# Altium schematic sheet WF-BT-AP6256.SchDoc
size 420 x 289 mm; SheetNumber: 31; SheetTotal: 32
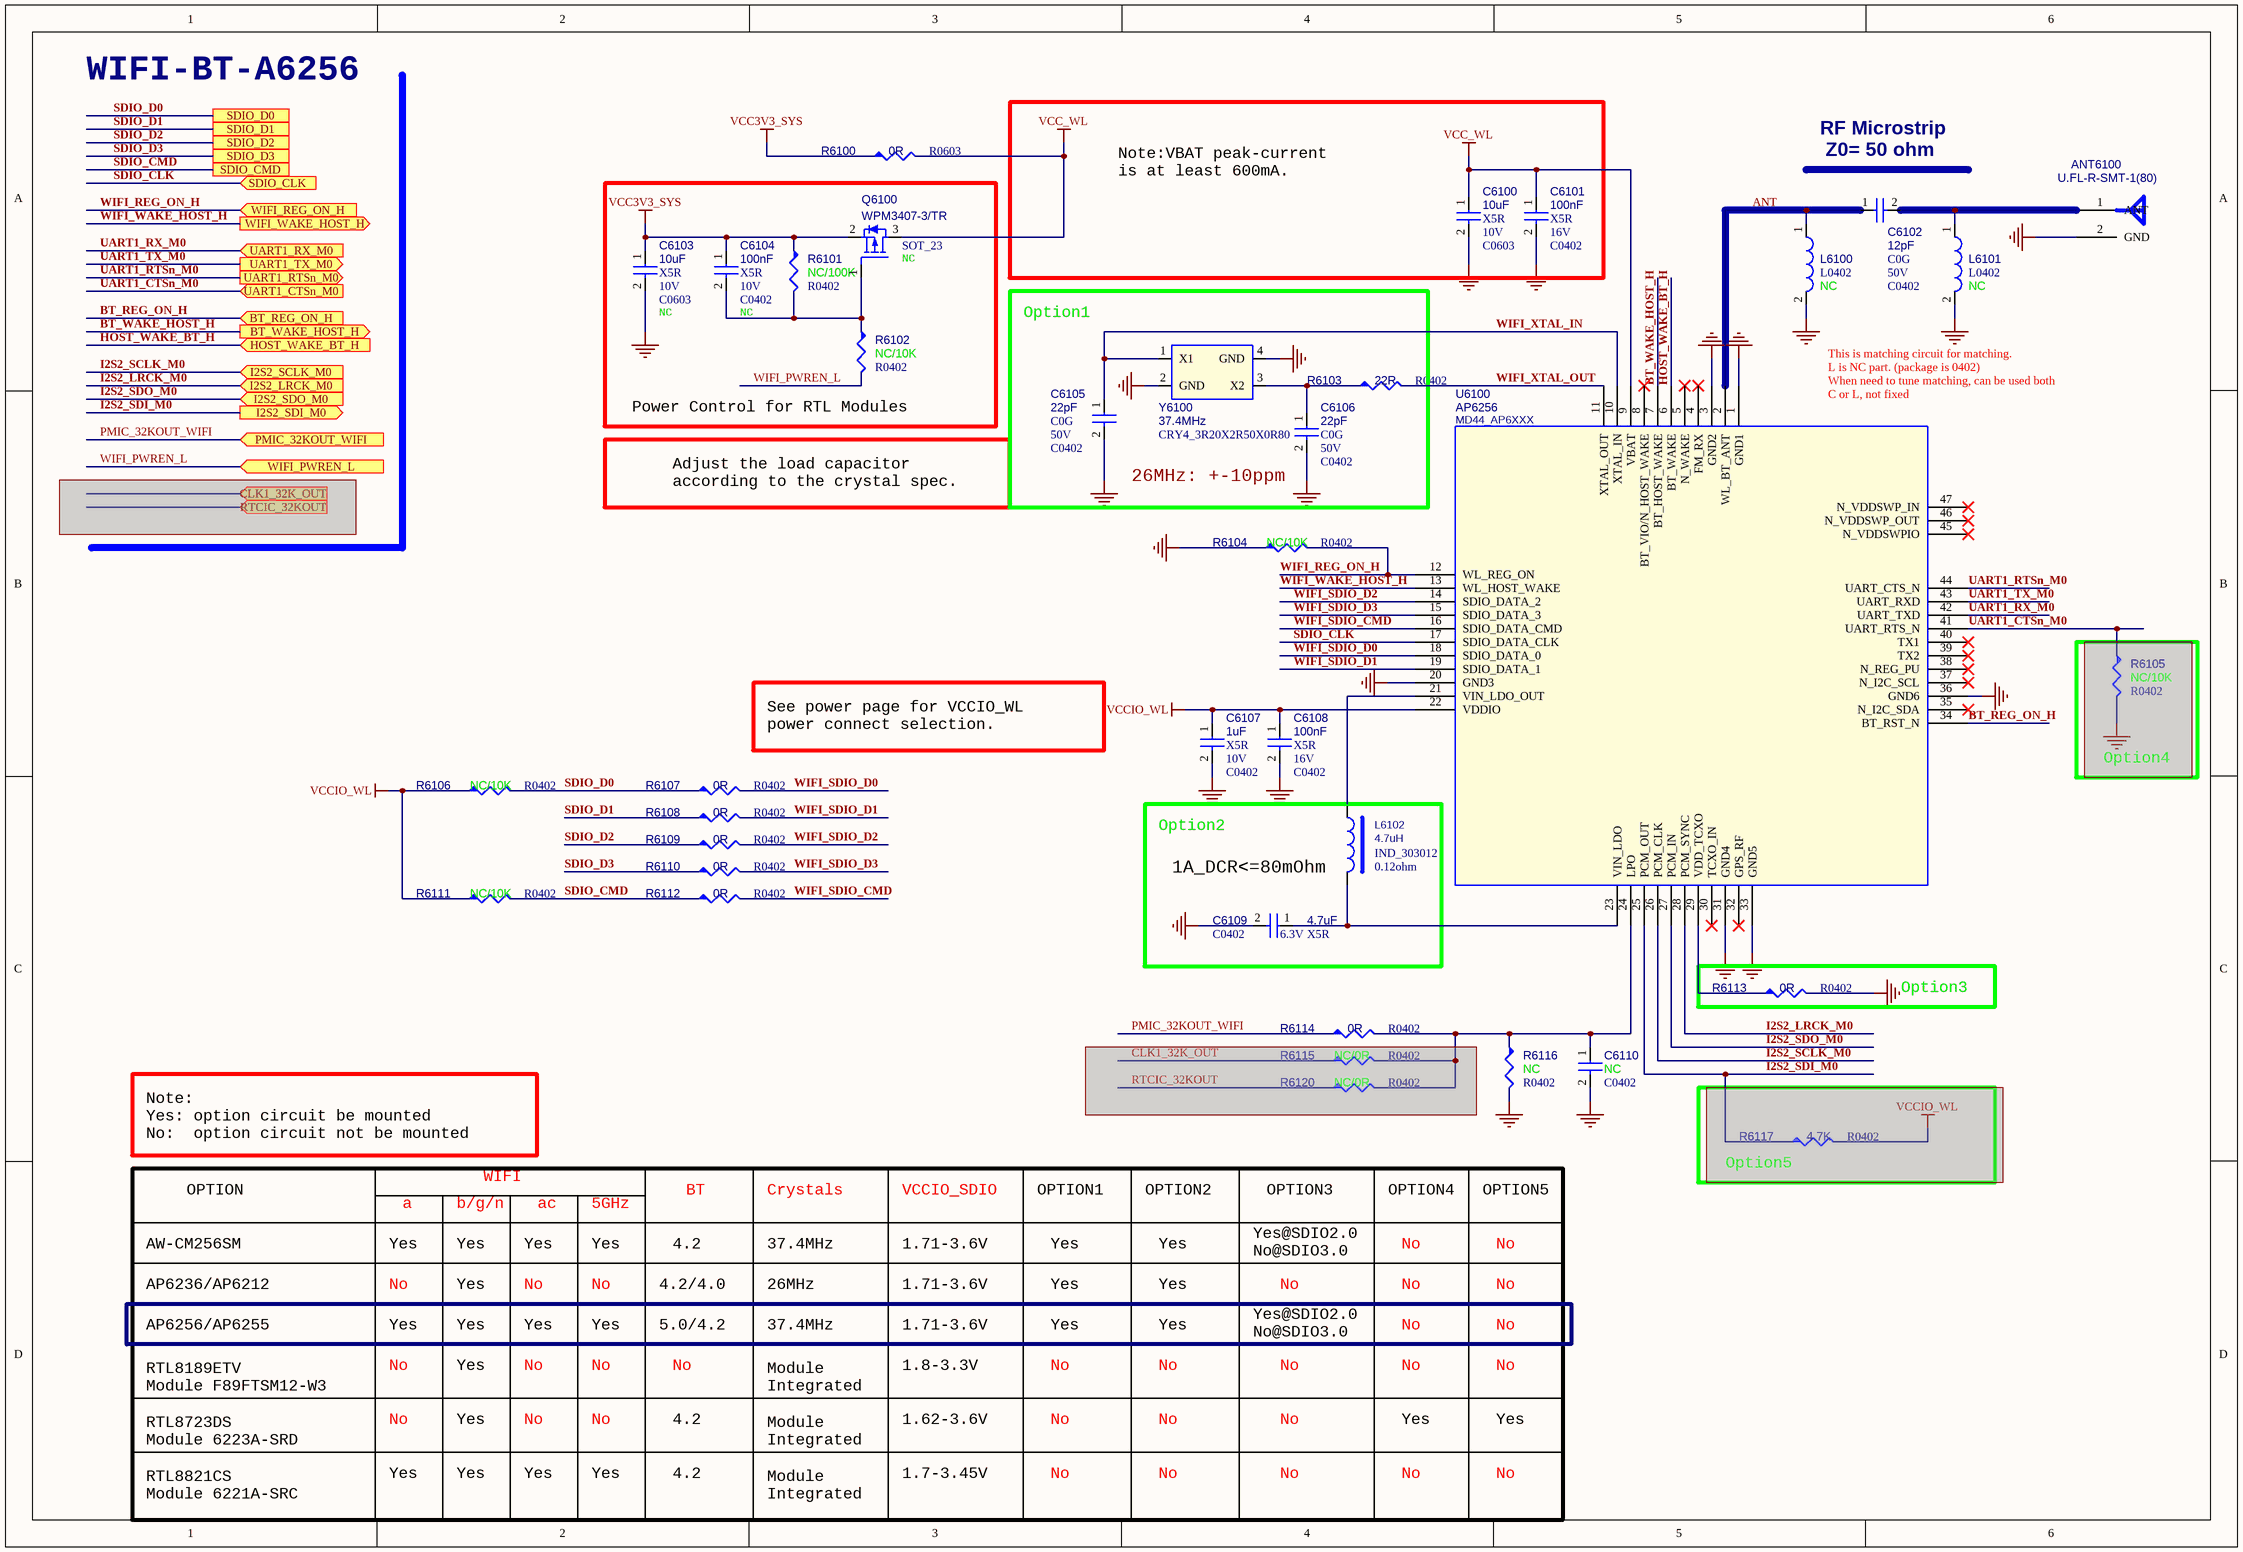
[diagram p0: WF-BT-AP6256.SchDoc]

## Parts
ANT6100  U.FL-R-SMT-1(80)  [IPEX-SMD_BWIPX-1-001E]
C6100  10uF  Dielectric: X5R  Voltage: 10V  [C0603]
C6101  100nF  Dielectric: X5R  Voltage: 16V  [C0402]
C6102  12pF  Dielectric: C0G  Voltage: 50V  [C0402]
C6103  10uF  Dielectric: X5R  Voltage: 10V  option: NC  [C0603]
C6104  100nF  Dielectric: X5R  Voltage: 10V  option: NC  [C0402]
C6105  22pF  Dielectric: C0G  Voltage: 50V  [C0402]
C6106  22pF  Dielectric: C0G  Voltage: 50V  [C0402]
C6107  1uF  Dielectric: X5R  Voltage: 10V  [C0402]
C6108  100nF  Dielectric: X5R  Voltage: 16V  [C0402]
C6109  4.7uF  Dielectric: X5R  Voltage: 6.3V  [C0402]
C6110  NC  [C0402]
L6100  NC  [L0402]
L6101  NC  [L0402]
L6102  4.7uH  PCB Footprint: IND_303012  DC Resistor: 0.12ohm  [IND_303015]
Q6100  WPM3407-3/TR  PCB Footprint: SOT_23  option: NC  [SOT23-3D]
R6100  0R  PCB Footprint: R0603  [R0402]
R6101  NC/100K  [R0402]
R6102  NC/10K  [R0402]
R6103  22R  [R0402]
R6104  NC/10K  [R0402]
R6105  NC/10K  [R0402]  (masked out: inside a compile mask, not in the netlist)
R6106  NC/10K  [R0402]
R6107  0R  [R0402]
R6108  0R  [R0402]
R6109  0R  [R0402]
R6110  0R  [R0402]
R6111  NC/10K  [R0402]
R6112  0R  [R0402]
R6113  0R  [R0402]
R6114  0R  [R0402]
R6115  NC/0R  [R0402]  (masked out: inside a compile mask, not in the netlist)
R6116  NC  [R0402]
R6117  4.7K  [R0402]  (masked out: inside a compile mask, not in the netlist)
R6120  NC/0R  [R0402]  (masked out: inside a compile mask, not in the netlist)
U6100  AP6256  PCB Footprint: MD44_AP6XXX  [QFN-44_L12.0-W12.0-P0.90-TL_AP6256]
Y6100  37.4MHz  [CRY4_3R20X2R50X0R80]

## Blocks framed on the sheet
Power Control for RTL Modules: C6103 C6104 Q6100 R6101 R6102
26MHz: +-10ppm: C6105 C6106 R6103 Y6100
Option4: R6105
1A_DCR<=80mOhm: C6109 L6102
Option3: R6113
Option5: R6117

## Ports
BT_REG_ON_H (in, see Controller-RK3562-TOP[7D], CONTROLLER-RK3562[7A], RK3562-PMUIO-OSC-PLL[5C]), BT_WAKE_HOST_H (out, see Controller-RK3562-TOP[7D], CONTROLLER-RK3562[7A], RK3562-PMUIO-OSC-PLL[5C]), CLK1_32K_OUT (in, see Controller-RK3562-TOP[7D], CONTROLLER-RK3562[7A]), HOST_WAKE_BT_H (in, see Controller-RK3562-TOP[7D], CONTROLLER-RK3562[7A], RK3562-PMUIO-OSC-PLL[5C]), I2S2_LRCK_M0 (in, see Controller-RK3562-TOP[7D], CONTROLLER-RK3562[3B], RK3562-VCCIO4[4B]), I2S2_SCLK_M0 (in, see Controller-RK3562-TOP[7D], CONTROLLER-RK3562[3B], RK3562-VCCIO4[4B]), I2S2_SDI_M0 (out, see Controller-RK3562-TOP[7D], CONTROLLER-RK3562[3B], RK3562-VCCIO4[4B]), I2S2_SDO_M0 (in, see Controller-RK3562-TOP[7D], CONTROLLER-RK3562[3B], RK3562-VCCIO4[4B]), PMIC_32KOUT_WIFI (in, see Controller-RK3562-TOP[7D], CONTROLLER-RK3562[1B], RK-POWER-SUPPLY[1A]), RTCIC_32KOUT (in, see Controller-RK3562-TOP[7D], CONTROLLER-RK3562[7A]), SDIO_CLK (in, see Controller-RK3562-TOP[7D], CONTROLLER-RK3562[3B], RK3562-VCCIO4[4A]), SDIO_CMD (see Controller-RK3562-TOP[7D], CONTROLLER-RK3562[3B], RK3562-VCCIO4[4A]), SDIO_D0 (see Controller-RK3562-TOP[7D], CONTROLLER-RK3562[3B], RK3562-VCCIO4[4A]), SDIO_D1 (see Controller-RK3562-TOP[7D], CONTROLLER-RK3562[3B], RK3562-VCCIO4[4A]), SDIO_D2 (see Controller-RK3562-TOP[7D], CONTROLLER-RK3562[3B], RK3562-VCCIO4[4A]), SDIO_D3 (see Controller-RK3562-TOP[7D], CONTROLLER-RK3562[3B], RK3562-VCCIO4[4A]), UART1_CTSn_M0 (in, see Controller-RK3562-TOP[7D], CONTROLLER-RK3562[3B], RK3562-VCCIO4[4B]), UART1_RTSn_M0 (out, see Controller-RK3562-TOP[7D], CONTROLLER-RK3562[3B], RK3562-VCCIO4[4B]), UART1_RX_M0 (in, see Controller-RK3562-TOP[7D], CONTROLLER-RK3562[3B]), UART1_TX_M0 (out, see Controller-RK3562-TOP[7D], CONTROLLER-RK3562[3B]), WIFI_PWREN_L (in, see Controller-RK3562-TOP[7D], CONTROLLER-RK3562[7A]), WIFI_REG_ON_H (in, see Controller-RK3562-TOP[7D], CONTROLLER-RK3562[7A], RK3562-PMUIO-OSC-PLL[5C]), WIFI_WAKE_HOST_H (out, see Controller-RK3562-TOP[7D], CONTROLLER-RK3562[7A], RK3562-PMUIO-OSC-PLL[5C])

## Nets
GND: ANT6100.2(GND) C6100.2 C6101.2 C6103.2 C6105.2 C6106.2 C6107.2 C6108.2 C6109.2 C6110.2 L6100.2 L6101.2 R6104.1 R6113.2 R6116.2 U6100.1(GND1) U6100.3(GND2) U6100.20(GND3) U6100.31(GND4) U6100.33(GND5) U6100.36(GND6) Y6100.2(GND) Y6100.4(GND)
VCC3V3_SYS: C6103.1 C6104.1 Q6100.2(SOURCE) R6100.1 R6101.1
VCC_WL: C6100.1 C6101.1 Q6100.3(DRAIN) R6100.2 U6100.9(VBAT)
VCCIO_WL: C6107.1 C6108.1 R6106.1 R6111.1 U6100.22(VDDIO)
ANT: C6102.1 L6100.1 U6100.2(WL_BT_ANT)
BT_REG_ON_H: U6100.34(BT_RST_N) ; port BT_REG_ON_H
BT_WAKE_HOST_H: U6100.7(BT_HOST_WAKE) ; port BT_WAKE_HOST_H
HOST_WAKE_BT_H: U6100.6(BT_WAKE) ; port HOST_WAKE_BT_H
I2S2_LRCK_M0: U6100.28(PCM_SYNC) ; port I2S2_LRCK_M0
I2S2_SCLK_M0: U6100.26(PCM_CLK) ; port I2S2_SCLK_M0
I2S2_SDI_M0: U6100.25(PCM_OUT) ; port I2S2_SDI_M0
I2S2_SDO_M0: U6100.27(PCM_IN) ; port I2S2_SDO_M0
PMIC_32KOUT_WIFI: R6114.1 ; port PMIC_32KOUT_WIFI
SDIO_CLK: U6100.17(SDIO_DATA_CLK) ; port SDIO_CLK
SDIO_CMD: R6111.2 R6112.1 ; port SDIO_CMD
SDIO_D0: R6106.2 R6107.1 ; port SDIO_D0
SDIO_D1: R6108.1 ; port SDIO_D1
SDIO_D2: R6109.1 ; port SDIO_D2
SDIO_D3: R6110.1 ; port SDIO_D3
UART1_CTSn_M0: U6100.41(UART_RTS_N) ; port UART1_CTSn_M0
UART1_RTSn_M0: U6100.44(UART_CTS_N) ; port UART1_RTSn_M0
UART1_RX_M0: U6100.42(UART_TXD) ; port UART1_RX_M0
UART1_TX_M0: U6100.43(UART_RXD) ; port UART1_TX_M0
WIFI_PWREN_L: R6102.2 ; port WIFI_PWREN_L
WIFI_REG_ON_H: R6104.2 U6100.12(WL_REG_ON) ; port WIFI_REG_ON_H
WIFI_SDIO_CMD: R6112.2 U6100.16(SDIO_DATA_CMD)
WIFI_SDIO_D0: R6107.2 U6100.18(SDIO_DATA_0)
WIFI_SDIO_D1: R6108.2 U6100.19(SDIO_DATA_1)
WIFI_SDIO_D2: R6109.2 U6100.14(SDIO_DATA_2)
WIFI_SDIO_D3: R6110.2 U6100.15(SDIO_DATA_3)
WIFI_WAKE_HOST_H: U6100.13(WL_HOST_WAKE) ; port WIFI_WAKE_HOST_H
WIFI_XTAL_IN: C6105.1 U6100.10(XTAL_IN) Y6100.1(X1)
WIFI_XTAL_OUT: R6103.2 U6100.11(XTAL_OUT)
NetANT6100_1: ANT6100.1(ANT) C6102.2 L6101.1
NetC6104_2: C6104.2 Q6100.1(GATE) R6101.2 R6102.1
NetC6106_1: C6106.1 R6103.1 Y6100.3(X2)
NetC6109_1: C6109.1 L6102.2 U6100.23(VIN_LDO)
NetC6110_1: C6110.1 R6114.2 R6116.1 U6100.24(LPO)
NetL6102_1: L6102.1 U6100.21(VIN_LDO_OUT)
NetR6113_1: R6113.1 U6100.29(VDD_TCXO)

Not connected (* = marked no-connect by the designer): U6100 4(FM_RX)* 5(N_WAKE)* 8(BT_VIO/N_HOST_WAKE)* 30(TCXO_IN)* 32(GPS_RF)* 35(N_I2C_SDA)* 37(N_I2C_SCL)* 38(N_REG_PU)* 39(TX2)* 40(TX1)* 45(N_VDDSWPIO)* 46(N_VDDSWP_OUT)* 47(N_VDDSWP_IN)*

## Notes on the sheet
- WIFI-BT-A6256
- RF Microstrip
  Z0= 50 ohm
- Note:VBAT peak-current
  is at least 600mA.
- Option1
- (near U6100) This is matching circuit for matching.
  L is NC part. (package is 0402)
  When need to tune matching, can be used both C or L, not fixed
- Adjust the load capacitor
  according to the crystal spec.
- See power page for VCCIO_WL
  power connect selection.
- Option2
- Note:
  Yes: option circuit be mounted
  No:  option circuit not be mounted
- OPTION
- a
- b/g/n
- WIFI
- ac
- 5GHz
- BT
- Crystals
- VCCIO_SDIO
- OPTION1
- OPTION2
- OPTION3
- OPTION4
- OPTION5
- AW-CM256SM
- AP6236/AP6212
- Yes
- No
- 4.2/4.0
- 4.2
- 37.4MHz
- 26MHz
- 1.71-3.6V
- Yes@SDIO2.0
  No@SDIO3.0
- AP6256/AP6255
- 5.0/4.2
- 1.8-3.3V
- RTL8189ETV
  Module F89FTSM12-W3
- Module
  Integrated
- 1.62-3.6V
- RTL8723DS
  Module 6223A-SRD
- RTL8821CS
  Module 6221A-SRC
- 1.7-3.45V

## Library data of the parts
ANT6100 = ANT_1P1G: BWIPX-1-001E; Manufacturer: Rockchip
C6100 = CAP NP: cap,10.00uF,+/-10%,10V,X5R,C0603; Part Reference: C6100; Manufacturer PN: C1608X5R1A106K080AC; Manufacturer: TDK; Tolerance: 10%; Priority: A; PCB Footprint: C0603; Value: 10uF; Created by: JJJ; Part Type: C0603; RK PN: C1608X5R1A106K080AC
C6101 = CAP NP: cap,100.00nF,+/-10%,16V,X5R,C0402; Part Reference: C6101; Manufacturer PN: C1005X5R1C104K050BA; Manufacturer: TDK; C_Voltage: 10V; Tolerance: 10%; Priority: A; Number: 37; PCB Footprint: C0402; Value: 100nF; Created by: JJJ; Part Type: C0402; RK PN: C1005X5R1C104K050BA
C6102 = CAP NP: cap,10.00pF,+/-0.5,50V,C0G,C0402; Part Reference: C6102; Manufacturer: TDK; Priority: A; Tolerance: +/-0.5pF; PCB Footprint: C0402; Value: 12pF; Part Type: C0402; Created by: JJJ
C6103 = CAP NP: cap,10.00uF,+/-10%,10V,X5R,C0603; Part Reference: C6103; Manufacturer PN: C1608X5R1A106K080AC; Manufacturer: TDK; Tolerance: 10%; C_Voltage: 6.3V; Priority: A; PCB Footprint: C0603; Value: 10uF; Created by: JJJ; Part Type: C0603; RK PN: C1608X5R1A106K080AC
C6104 = CAP NP: cap,100.00nF,+/-10%,10V,X5R,C0402; Part Reference: C6104; Manufacturer: TDK; Number: 37; RK PN: C1005X5R1A104K050BA; Priority: A; Tolerance: 10%; C_Voltage: 6.3V; PCB Footprint: C0402; Value: 100nF; Part Type: C0402; Manufacturer PN: C1005X5R1A104K050BA; Created by: JJJ
C6105 = CAP NP: cap,22.00pF,+/-5%,50V,C0G,C0402; Part Reference: C6105; Manufacturer: TDK; RK PN: C1005C0G1H220J050BA; Priority: A; Tolerance: 5%; PCB Footprint: C0402; Value: 22pF; Part Type: C0402; Manufacturer PN: C1005C0G1H220J050BA; Created by: JJJ
C6106 = CAP NP: cap,22.00pF,+/-5%,50V,C0G,C0402; Part Reference: C6106; Manufacturer: TDK; RK PN: C1005C0G1H220J050BA; Priority: A; Tolerance: 5%; PCB Footprint: C0402; Value: 22pF; Part Type: C0402; Manufacturer PN: C1005C0G1H220J050BA; Created by: JJJ
C6107 = CAP NP: cap,1.00uF,+/-10%,10V,X5R,C0402; Part Reference: C6107; Manufacturer PN: C1005X5R1A105K050BB; Manufacturer: TDK; Tolerance: 10%; Priority: A; PCB Footprint: C0402; Value: 1uF; Created by: JJJ; Part Type: C0402; RK PN: C1005X5R1A105K050BB
C6108 = CAP NP: cap,100.00nF,+/-10%,16V,X5R,C0402; Part Reference: C6108; Manufacturer: TDK; Number: 37; RK PN: C1005X5R1C104K050BA; Priority: A; Tolerance: 10%; C_Voltage: 10V; PCB Footprint: C0402; Value: 100nF; Part Type: C0402; Manufacturer PN: C1005X5R1C104K050BA; Created by: JJJ
C6109 = CAP NP: cap,4.70uF,+/-10%,6.3V,X5R,C0402; Part Reference: C6109; Manufacturer: TDK; RK PN: C1005X5R0J475K050BC; Priority: A; Tolerance: 10%; PCB Footprint: C0402; Value: 4.7uF; Part Type: C0402; Manufacturer PN: C1005X5R0J475K050BC; Created by: JJJ
C6110 = CAP NP_NC: NC电容，无容值.; Part Reference: C6110; Optional: X; Priority: A; RK PN: 902012106-1; PCB Footprint: C0402; Value: NC; Created by: JJJ; Part Type: NC电容
L6100 = INDUCTOR: Did Not Place.; Part Reference: L6100; RK PN: DNPL0402; Priority: A; PCB Footprint: L0402; Value: NC; Part Type: IND; Created by: JJJ
L6101 = INDUCTOR: Did Not Place.; Part Reference: L6101; Priority: A; RK PN: DNPL0402; PCB Footprint: L0402; Value: NC; Created by: JJJ; Part Type: IND
L6102 = INDUCTORS OF FERRITE: Power Inductor,4.7uH,0.2,IND_303012; Part Reference: L6102; Manufacturer: sunlord; Isat: 0.90A; RK PN: SWPA3012S4R7MT; Priority: A; Tolerance: 20%; Irms: 1.24A; Resonace frequency: 61M; Value: 4.7uH; Part Type: POWER_IND; Manufacturer PN: SWPA3012S4R7MT; Created by: YTL
Q6100 = MOSFET P_Dup1: PMOS,WPM3407-3/TR,SOT_23,Id=4.4A,Vds=30V; Part Reference: Q6100; Manufacturer: WillSemi(韦尔半导体); Pd: 0.9W; Vgsth: 2.0V; VDS: 30V; Vgs: ±20V; Id_max: 4.4A; Priority: A; Value: WPM3407-3/TR; Created by: JJJ; Manufacturer PN: WPM3407-3/TR; Part Type: PMOS; RK PN: WPM3407-3/TR
R6100 = RESISTOR5: 通用厚膜电阻,0R,+/-5%,R0603,1/10W.; Part Reference: R6100; Manufacturer: YAGEO; Manufacturer PN: RC0603JR-070RL; Tolerance: 5%; RK PN: 901002435; Priority: A; Wattage: 1/10W; Value: 0R; Part Type: 通用厚膜电阻; Created by: YTL
R6101 = RESISTOR5_NC: 通用厚膜电阻,100K,+/-5%,R0402,1/16W.; Part Reference: R6101; Manufacturer: YAGEO; Manufacturer PN: RC0402JR-07100KL; Tolerance: 5%; RK PN: 901001447-1; Priority: A; Wattage: 1/16W; Optional: X; PCB Footprint: R0402; Value: NC/100K; Part Type: 通用厚膜电阻; Created by: YTL
R6102 = RESISTOR5_NC: 通用厚膜电阻,10K,+/-5%,R0402,1/16W.; Part Reference: R6102; Manufacturer PN: RC0402JR-0710KL; Manufacturer: YAGEO; Tolerance: 5%; Optional: X; Wattage: 1/16W; Priority: A; RK PN: 901001449-1; PCB Footprint: R0402; Value: NC/10K; Created by: YTL; Part Type: 通用厚膜电阻
R6103 = RESISTOR5: 通用厚膜电阻,22R,+/-5%,R0402,1/16W.; Part Reference: R6103; Manufacturer: YAGEO; Manufacturer PN: RC0402JR-0722RL; Tolerance: 5%; RK PN: 901001505; Priority: A; Wattage: 1/16W; PCB Footprint: R0402; Value: 22R; Part Type: 通用厚膜电阻; Created by: YTL
R6104 = RESISTOR5_NC: 通用厚膜电阻,10K,+/-5%,R0402,1/16W.; Part Reference: R6104; Manufacturer: YAGEO; Manufacturer PN: RC0402JR-0710KL; Tolerance: 5%; RK PN: 901001449-1; Priority: A; Wattage: 1/16W; Optional: X; PCB Footprint: R0402; Value: NC/10K; Part Type: 通用厚膜电阻; Created by: YTL
R6105 = RESISTOR5_NC: 通用厚膜电阻,10K,+/-5%,R0402,1/16W.; Part Reference: R6105; Manufacturer PN: RC0402JR-0710KL; Manufacturer: YAGEO; Tolerance: 5%; Optional: X; Wattage: 1/16W; Priority: A; RK PN: 901001449-1; PCB Footprint: R0402; Value: NC/10K; Created by: YTL; Part Type: 通用厚膜电阻
R6106 = RESISTOR5_NC: 通用厚膜电阻,10K,+/-5%,R0402,1/16W.; Part Reference: R6106; Manufacturer: YAGEO; Manufacturer PN: RC0402JR-0710KL; Tolerance: 5%; RK PN: 901001449-1; Priority: A; Wattage: 1/16W; Optional: X; PCB Footprint: R0402; Value: NC/10K; Part Type: 通用厚膜电阻; Created by: YTL
R6107 = RESISTOR5: 通用厚膜电阻,0R,+/-5%,R0402,1/16W.; Part Reference: R6107; Manufacturer: YAGEO; Manufacturer PN: RC0402JR-070RL; Tolerance: 5%; RK PN: 901001446; Priority: A; Wattage: 1/16W; PCB Footprint: R0402; Value: 0R; Part Type: 通用厚膜电阻; Created by: YTL
R6108 = RESISTOR5: 通用厚膜电阻,0R,+/-5%,R0402,1/16W.; Part Reference: R6108; Manufacturer: YAGEO; Manufacturer PN: RC0402JR-070RL; Tolerance: 5%; RK PN: 901001446; Priority: A; Wattage: 1/16W; PCB Footprint: R0402; Value: 0R; Part Type: 通用厚膜电阻; Created by: YTL
R6109 = RESISTOR5: 通用厚膜电阻,0R,+/-5%,R0402,1/16W.; Part Reference: R6109; Manufacturer: YAGEO; Manufacturer PN: RC0402JR-070RL; Tolerance: 5%; RK PN: 901001446; Priority: A; Wattage: 1/16W; PCB Footprint: R0402; Value: 0R; Part Type: 通用厚膜电阻; Created by: YTL
R6110 = RESISTOR5: 通用厚膜电阻,0R,+/-5%,R0402,1/16W.; Part Reference: R6110; Manufacturer: YAGEO; Manufacturer PN: RC0402JR-070RL; Tolerance: 5%; RK PN: 901001446; Priority: A; Wattage: 1/16W; PCB Footprint: R0402; Value: 0R; Part Type: 通用厚膜电阻; Created by: YTL
R6111 = RESISTOR5_NC: 通用厚膜电阻,10K,+/-5%,R0402,1/16W.; Part Reference: R6111; Manufacturer: YAGEO; Manufacturer PN: RC0402JR-0710KL; Tolerance: 5%; RK PN: 901001449-1; Priority: A; Wattage: 1/16W; Optional: X; PCB Footprint: R0402; Value: NC/10K; Part Type: 通用厚膜电阻; Created by: YTL
R6112 = RESISTOR5: 通用厚膜电阻,0R,+/-5%,R0402,1/16W.; Part Reference: R6112; Manufacturer: YAGEO; Manufacturer PN: RC0402JR-070RL; Tolerance: 5%; RK PN: 901001446; Priority: A; Wattage: 1/16W; PCB Footprint: R0402; Value: 0R; Part Type: 通用厚膜电阻; Created by: YTL
R6113 = RESISTOR5: 通用厚膜电阻,0R,+/-5%,R0402,1/16W.; Part Reference: R6113; Manufacturer PN: RC0402JR-070RL; Manufacturer: YAGEO; Tolerance: 5%; Wattage: 1/16W; Priority: A; RK PN: 901001446; PCB Footprint: R0402; Value: 0R; Created by: YTL; Part Type: 通用厚膜电阻
R6114 = RESISTOR5: 通用厚膜电阻,0R,+/-5%,R0402,1/16W.; Part Reference: R6114; Manufacturer PN: RC0402JR-070RL; Manufacturer: YAGEO; Tolerance: 5%; Wattage: 1/16W; Priority: A; RK PN: 901001446; PCB Footprint: R0402; Value: 0R; Created by: YTL; Part Type: 通用厚膜电阻
R6115 = RESISTOR5_NC: 通用厚膜电阻,0R,+/-5%,R0402,1/16W.; Part Reference: R6115; Manufacturer PN: RC0402JR-070RL; Manufacturer: YAGEO; Tolerance: 5%; Optional: X; Wattage: 1/16W; Priority: A; RK PN: 901001446-1; PCB Footprint: R0402; Value: NC/0R; Created by: YTL; Part Type: 通用厚膜电阻
R6116 = RESISTOR5_NC: NC电阻，无阻值.; Part Reference: R6116; Optional: X; Priority: A; RK PN: 901006427-1; PCB Footprint: R0402; Value: NC; Created by: JJJ; Part Type: NC电阻
R6117 = RESISTOR5: 通用厚膜电阻,4K7,+/-5%,R0402,1/16W.; Part Reference: R6117; Manufacturer: YAGEO; Manufacturer PN: RC0402JR-074K7L; Tolerance: 5%; RK PN: 901001562; Priority: A; Wattage: 1/16W; PCB Footprint: R0402; Value: 4.7K; Part Type: 通用厚膜电阻; Created by: YTL
R6120 = RESISTOR5_NC: 通用厚膜电阻,0R,+/-5%,R0402,1/16W.; Part Reference: R6120; Manufacturer: YAGEO; Manufacturer PN: RC0402JR-070RL; Tolerance: 5%; RK PN: 901001446-1; Priority: A; Wattage: 1/16W; Optional: X; PCB Footprint: R0402; Value: NC/0R; Part Type: 通用厚膜电阻; Created by: YTL
U6100 = MODULE_AP6XXX: WiFi 802.11b/g/n + BT4.0; Part Reference: U6100; Manufacturer PN: RL-SM02BD; Manufacturer: RF-LINK(博鹏发); Priority: A; Value: AP6256; Created by: JJJ; Part Type: module; RK PN: RL-SM02BD
Y6100 = CRYSTAL_4P: 无源晶振，26M，3225,±10ppm，8pF，Hosonic; Part Reference: Y6100; Manufacturer: Hosonic(鸿星电子); Manufacturer PN: HCX-3SB26.0000; Value: 26MHz; RK PN: 26MHz_Hosonic; Priority: A; PCB Footprint: CRY4_3R20X2R50X0R80; Part Type: CRYSTAL; Created by: JJJ